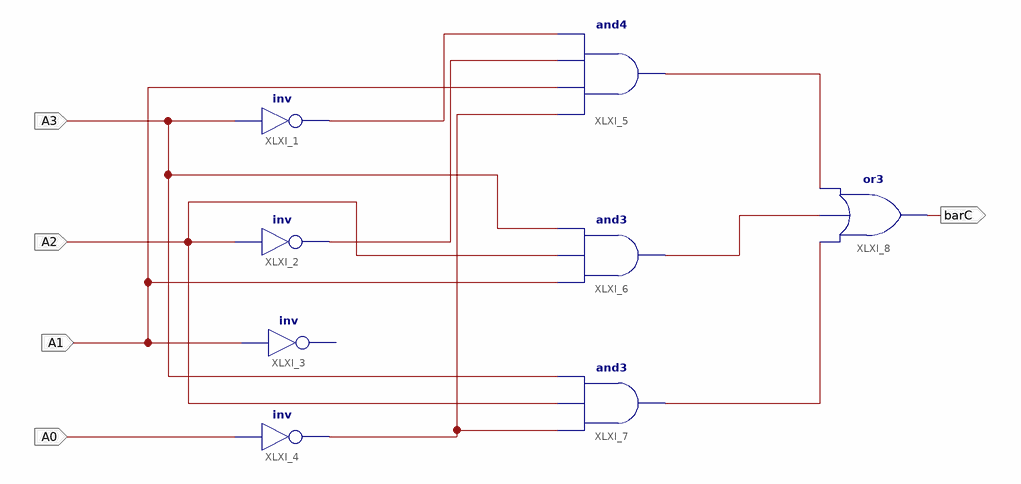
[diagram p0: schematic sheet 1]
// Xilinx ISE schematic fnd3.sch (spartan6) as structural Verilog: 8 symbols, 5 ports
module fnd3 (
  input  A1,
  input  A3,
  input  A2,
  input  A0,
  output barC
);

  wire XLXN_8, XLXN_9, XLXN_11, XLXN_15, XLXN_16, XLXN_17;

  not XLXI_1 (XLXN_8, A3);
  not XLXI_2 (XLXN_9, A2);
  // inv XLXI_3 has open pins: I=A1, O=open
  not XLXI_4 (XLXN_11, A0);
  and XLXI_5 (XLXN_15, XLXN_11, A1, XLXN_9, XLXN_8);
  and XLXI_6 (XLXN_16, A1, A2, A3);
  and XLXI_7 (XLXN_17, XLXN_11, A2, A3);
  or XLXI_8 (barC, XLXN_17, XLXN_16, XLXN_15);
endmodule
